# Altium schematic sheet MIC.SchDoc
size A4
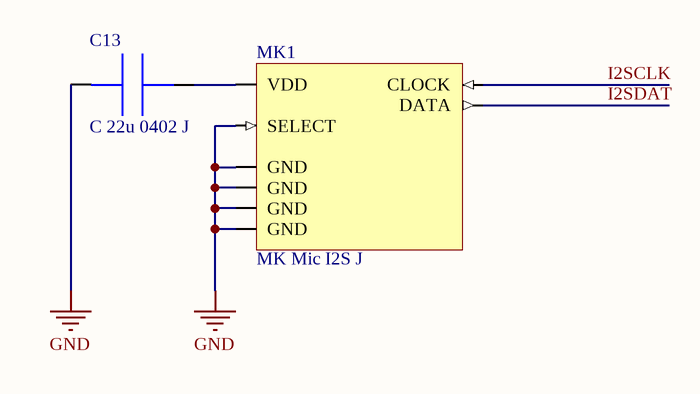
[diagram p0: MIC.SchDoc]

## Parts
C13  C 22u 0402 J  [C0402]
MK1  MK Mic I2S J  [MK WMM7040DTHN0]

## Nets
GND: C13.1 MK1.2(SELECT) MK1.5(GND) MK1.6(GND) MK1.7(GND) MK1.8(GND)
I2SCLK: MK1.3(CLOCK)
I2SDAT: MK1.4(DATA)
NetC13_2: C13.2 MK1.1(VDD)

## Library data of the parts
C13 = C 22u 0402 J: Multi-Layer Ceramic Capacitor 22uF 2.5VDC X6S 20% 0402 Paper T/R GRM155C80E226ME11D; Manufacturer: Murata; Supplier 1: Mouser; Manufacturer Part Number: GRM155C80E226ME11D; RoHS: Yes; Category: Ceramic Capacitors; Stock 1: 30000; Pricing 1: 1=0,32000, 10=0,22300, 50=0,22300, 100=0,13400, 1000=0,08500, 10000=0,06900 (USD); Supplier Part Number 1: 81-GRM155C80E226ME1D; JLCPCB: C907955
MK1 = MK Mic I2S J: WILLSEMI(Will Semicon) SMD MEMS Microphones ROHS WMM7040DTHN0; Manufacturer: WILLSEMI(Will Semicon); Manufacturer Part Number: WMM7040DTHN0; JLCPCB: C2937733; ComponentLink1Description: Datasheet; ComponentLink1URL: https://datasheet.lcsc.com/lcsc/2204021130_WILLSEMI-Will-Semicon-WMM7040DTHN0-8-TR_C2937733.pdf